# Altium project hw_design.PrjPcb (part 4 of 5)

## Sheet power_regulation.SchDoc
size A3; SheetNumber: 4; SheetTotal: 5
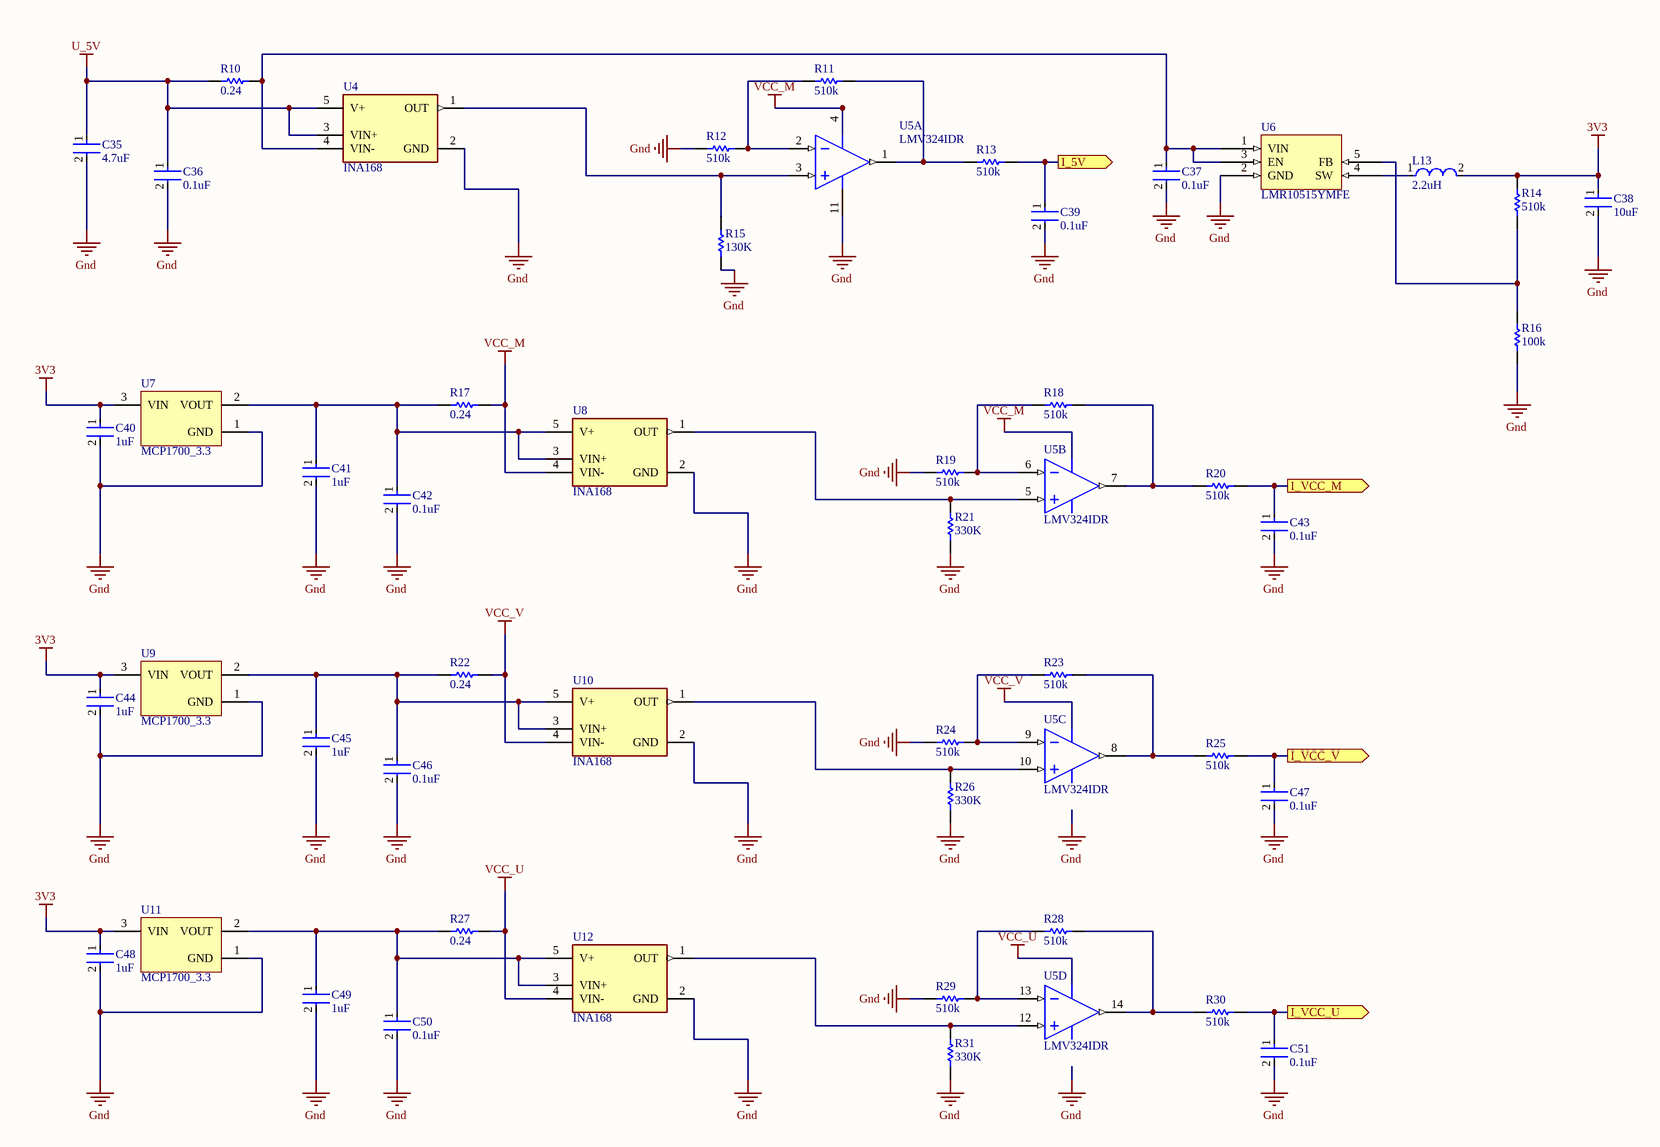
[diagram p3: power_regulation.SchDoc]

### Parts
C35  4.7uF  [FP-C0805C-DN-IPC_A]
C36  0.1uF  [FP-C0805C-DN-IPC_A]
C37  0.1uF  [FP-C0805C-DN-IPC_A]
C38  10uF  [FP-C0805C-DN-IPC_A]
C39  0.1uF  [FP-C0805C-DN-IPC_A]
C40  1uF  [FP-C0805C-DN-IPC_A]
C41  1uF  [FP-C0805C-DN-IPC_A]
C42  0.1uF  [FP-C0805C-DN-IPC_A]
C43  0.1uF  [FP-C0805C-DN-IPC_A]
C44  1uF  [FP-C0805C-DN-IPC_A]
C45  1uF  [FP-C0805C-DN-IPC_A]
C46  0.1uF  [FP-C0805C-DN-IPC_A]
C47  0.1uF  [FP-C0805C-DN-IPC_A]
C48  1uF  [FP-C0805C-DN-IPC_A]
C49  1uF  [FP-C0805C-DN-IPC_A]
C50  0.1uF  [FP-C0805C-DN-IPC_A]
C51  0.1uF  [FP-C0805C-DN-IPC_A]
L13  2.2uH  [FP-C0805C-DN-IPC_A]
R10  0.24  [FP-C0805C-DN-IPC_A]
R11  510k  [FP-C0805C-DN-IPC_A]
R12  510k  [FP-C0805C-DN-IPC_A]
R13  510k  [FP-C0805C-DN-IPC_A]
R14  510k  [FP-C0805C-DN-IPC_A]
R15  130K  [FP-C0805C-DN-IPC_A]
R16  100k  [FP-C0805C-DN-IPC_A]
R17  0.24  [FP-C0805C-DN-IPC_A]
R18  510k  [FP-C0805C-DN-IPC_A]
R19  510k  [FP-C0805C-DN-IPC_A]
R20  510k  [FP-C0805C-DN-IPC_A]
R21  330K  [FP-C0805C-DN-IPC_A]
R22  0.24  [FP-C0805C-DN-IPC_A]
R23  510k  [FP-C0805C-DN-IPC_A]
R24  510k  [FP-C0805C-DN-IPC_A]
R25  510k  [FP-C0805C-DN-IPC_A]
R26  330K  [FP-C0805C-DN-IPC_A]
R27  0.24  [FP-C0805C-DN-IPC_A]
R28  510k  [FP-C0805C-DN-IPC_A]
R29  510k  [FP-C0805C-DN-IPC_A]
R30  510k  [FP-C0805C-DN-IPC_A]
R31  330K  [FP-C0805C-DN-IPC_A]
U4  INA168  [FP-DBV0005A-IPC_A]
U5  LMV324IDR  [D0014A_V]  (parts A,B,C,D of 4)
U6  LMR10515YMFE  [SOT95P245X145-5N]
U7  MCP1700_3.3  [SOT-23-TT3_L]
U8  INA168  [FP-DBV0005A-IPC_A]
U9  MCP1700_3.3  [SOT-23-TT3_L]
U10  INA168  [FP-DBV0005A-IPC_A]
U11  MCP1700_3.3  [SOT-23-TT3_L]
U12  INA168  [FP-DBV0005A-IPC_A]

### Ports
I_5V (out), I_VCC_M (out), I_VCC_U (out), I_VCC_V (out)

### Nets
3V3: C38.1 C40.1 C44.1 C48.1 L13.2 R14.2 U7.3(VIN) U9.3(VIN) U11.3(VIN)
GND: C35.2 C36.2 C37.2 C38.2 C39.2 C40.2 C41.2 C42.2 C43.2 C44.2 C45.2 C46.2 C47.2 C48.2 C49.2 C50.2 C51.2 R12.2 R15.1 R16.1 R19.2 R21.1 R24.2 R26.1 R29.2 R31.1 U4.2(GND) U5.11(GND) U6.2(GND) U7.1(GND) U8.2(GND) U9.1(GND) U10.2(GND) U11.1(GND) U12.2(GND)
U_5V: C35.1 C36.1 R10.1 U4.3(VIN+) U4.5(V+)
VCC_M: R17.2 U5.4(VCC+) U8.4(VIN-)
VCC_U: R27.2 U12.4(VIN-)
VCC_V: R22.2 U10.4(VIN-)
I_5V: C39.1 R13.1 ; port I_5V
I_VCC_M: C43.1 R20.1 ; port I_VCC_M
I_VCC_U: C51.1 R30.1 ; port I_VCC_U
I_VCC_V: C47.1 R25.1 ; port I_VCC_V
NetC37_1: C37.1 R10.2 U4.4(VIN-) U6.1(VIN) U6.3(EN)
NetC41_1: C41.1 C42.1 R17.1 U7.2(VOUT) U8.3(VIN+) U8.5(V+)
NetC45_1: C45.1 C46.1 R22.1 U9.2(VOUT) U10.3(VIN+) U10.5(V+)
NetC49_1: C49.1 C50.1 R27.1 U11.2(VOUT) U12.3(VIN+) U12.5(V+)
NetL13_1: L13.1 U6.4(SW)
NetR11_1: R11.1 R13.2 U5.1(1OUT)
NetR11_2: R11.2 R12.1 U5.2(1IN-)
NetR14_1: R14.1 R16.2 U6.5(FB)
NetR15_2: R15.2 U4.1(OUT) U5.3(1IN+)
NetR18_1: R18.1 R20.2 U5.7(1OUT)
NetR18_2: R18.2 R19.1 U5.6(1IN-)
NetR21_2: R21.2 U5.5(1IN+) U8.1(OUT)
NetR23_1: R23.1 R25.2 U5.8(1OUT)
NetR23_2: R23.2 R24.1 U5.9(1IN-)
NetR26_2: R26.2 U5.10(1IN+) U10.1(OUT)
NetR28_1: R28.1 R30.2 U5.14(1OUT)
NetR28_2: R28.2 R29.1 U5.13(1IN-)
NetR31_2: R31.2 U5.12(1IN+) U12.1(OUT)

### Library data of the parts
C35 = C0805C475K3PACTU: Cap Ceramic 4.7uF 25V X5R 10% SMD 0805 85°C Plastic T/R; Manufacturer: KEMET; Dissipation Factor: 5%; Supplier 1: Digi-Key; Manufacturer Part Number: C0805C475K3PACTU; RoHS: Yes; Category: Ceramic Capacitors; Pricing 1: 1=0.36000, 10=0.24800, 50=0.16500, 100=0.14020, 500=0.09900, 1000=0.08662 (USD); Mount: PCB,Surface Mount; Case/Package: 0805; Number of Pins: 2; Case Code (Imperial): 0805; Case Code (Metric): 2012; Dielectric Material: Ceramic; Contact Plating: Tin,Matte; Min Operating Temperature: -55°C; Max Operating Temperature: 85°C; Capacitance: 4.7uF; Tolerance: 10%; Packaging: Tape and Reel; Dielectric: X5R; Package Quantity: 2500; Series: C0805C; Termination: SMD/SMT; Voltage Rating (DC): 25V; Construction: Flat; Voltage: 25V; Length: 2mm; Width: 1.2mm; Height: 1.25mm; Depth: 1.25mm; Radiation Hardening: No; RoHS Compliant: Yes; Lead Free: Lead Free; REACH SVHC: No SVHC; ComponentLink1URL: https://datasheet.ciiva.com/3776/c0603c102k5racturegion-naregion-na-3776917.pdf?src-supplier=Arrow+Electronics; ComponentLink1Description: https://datasheet.ciiva.com/3776/c0603c102k5racturegion-naregion-na-3776917.pdf?src-supplier=Arrow+Electronics; ComponentLink2URL: https://datasheet.ciiva.com/18193/getdatasheetpartid-385757-18193895.pdf?src-supplier=Verical; ComponentLink2Description: https://datasheet.ciiva.com/18193/getdatasheetpartid-385757-18193895.pdf?src-supplier=Verical; ComponentLink3URL: https://datasheet.ciiva.com/18193/getdatasheetpartid-195812-18193898.pdf?src-supplier=Verical; ComponentLink3Description: https://datasheet.ciiva.com/18193/getdatasheetpartid-195812-18193898.pdf?src-supplier=Verical; ComponentLink4URL: https://datasheet.ciiva.com/7842/40889-7842614.pdf?src-supplier=Element14; ComponentLink4Description: https://datasheet.ciiva.com/7842/40889-7842614.pdf?src-supplier=Element14; ComponentLink5URL: https://datasheet.ciiva.com/22748/1918694-22748309.pdf?src-supplier=Element14; ComponentLink5Description: https://datasheet.ciiva.com/22748/1918694-22748309.pdf?src-supplier=Element14; Supplier Part Number 1: 399-C0805C475K3PAC7800CT-ND; Stock 1: 10860
C36 C37 C39 C42 C43 C46 C47 C50 C51 = C0805C104K5RACTU: Cap Ceramic 0.1uF 50V X7R 10% SMD 2.0 x 1.2 mm 125 C Paper T/R; Manufacturer: KEMET; Capacitance: 100nF; Voltage: 500V; Supplier 1: Digi-Key; Manufacturer Part Number: C0805C104K5RACTU; RoHS: Yes; Category: Ceramic Capacitors; Pricing 1: 1=0.15000, 10=0.10500, 50=0.05960, 100=0.04940, 500=0.03466, 1000=0.02869 (USD); Mount: Surface Mount,PCB; Case/Package: 0805; Number of Pins: 2; Case Code (Imperial): 0805; Case Code (Metric): 2012; Dielectric Material: Ceramic; Contact Plating: Tin,Matte; Min Operating Temperature: -55°C; Max Operating Temperature: 125°C; Package Quantity: 4000; Voltage Rating: 50V; Tolerance: 10%; Packaging: Tape and Reel; Dielectric: X7R; Termination: SMD/SMT; Voltage Rating (DC): 50V; Series: C0805C; Construction: Flat; Length: 2mm; Width: 1.2mm; Height: 0.9mm; Thickness: 0.035inch; Depth: 1.25mm; Lead Pitch: 0.75mm; Radiation Hardening: No; REACH SVHC: No SVHC; RoHS Compliant: Yes; ComponentLink1URL: https://www.distrelec.biz/Web/Downloads/_t/ds/KEM_C1002_X7R_SMD_eng_tds.pdf?mime=application%2Fpdf&src-supplier=Distrelec; ComponentLink1Description: https://www.distrelec.biz/Web/Downloads/_t/ds/KEM_C1002_X7R_SMD_eng_tds.pdf?mime=application%2Fpdf&src-supplier=Distrelec; ComponentLink2URL: http://www.farnell.com/datasheets/2740684.pdf?src-supplier=Farnell; ComponentLink2Description: http://www.farnell.com/datasheets/2740684.pdf?src-supplier=Farnell; ComponentLink3URL: http://www.farnell.com/datasheets/2740684.pdf?src-supplier=Element14; ComponentLink3Description: http://www.farnell.com/datasheets/2740684.pdf?src-supplier=Element14; Supplier Part Number 1: 399-C0805C104K5RAC7800CT-ND; Stock 1: 2034176
C38 = GRM21BR61C106KE15L: 贴片电容（MLCC） 10μF ±10% 16V X5R 0805; Manufacturer: Murata; Material: Ceramic; Supplier 1: Digi-Key; Manufacturer Part Number: GRM21BR61C106KE15L; RoHS: Yes; Category: Ceramic Capacitors; Pricing 1: 1=0.18000, 10=0.12400, 50=0.07420, 100=0.06270, 500=0.04292, 1000=0.03798 (USD); Mount: Surface Mount; Case/Package: 0805; Case Code (Imperial): 0805; Case Code (Metric): 2012; Min Operating Temperature: -55°C; Max Operating Temperature: 85°C; Packaging: Tape and Reel; Capacitance: 10uF; Tolerance: 10%; Voltage Rating: 16V; Voltage Rating (DC): 16V; Package Quantity: 1; Dielectric: X5R; Termination: SMD/SMT; Voltage: 16V; Series: GRM; Construction: Flat; Length: 2mm; Width: 1.25mm; Height: 1.25mm; Thickness: 0.053inch; Depth: 1.25mm; Radiation Hardening: No; REACH SVHC: No SVHC; RoHS Compliant: Yes; Lead Free: Lead Free; ComponentLink1URL: https://datasheet.ciiva.com/7719/1747468-7719090.pdf?src-supplier=Element14; ComponentLink1Description: https://datasheet.ciiva.com/7719/1747468-7719090.pdf?src-supplier=Element14; ComponentLink2URL: https://datasheet.ciiva.com/23628/460993-23628598.pdf?src-supplier=Newark; ComponentLink2Description: https://datasheet.ciiva.com/23628/460993-23628598.pdf?src-supplier=Newark; ComponentLink3URL: https://datasheet.ciiva.com/2989/product-2989696.pdf?src-supplier=Avnet; ComponentLink3Description: https://datasheet.ciiva.com/2989/product-2989696.pdf?src-supplier=Avnet; ComponentLink4URL: https://datasheet.ciiva.com/3777/1956grm21br61c106ke1523-3777137.pdf?src-supplier=Arrow+Electronics; ComponentLink4Description: https://datasheet.ciiva.com/3777/1956grm21br61c106ke1523-3777137.pdf?src-supplier=Arrow+Electronics; ComponentLink5URL: https://datasheet.ciiva.com/29202/450891-da-01-de-vs-chip-kond-0805-10-0-uf-10pr-16-0v-x5r-29202696.pdf?src-supplier=Conrad; ComponentLink5Description: https://datasheet.ciiva.com/29202/450891-da-01-de-vs-chip-kond-0805-10-0-uf-10pr-16-0v-x5r-29202696.pdf?src-supplier=Conrad; ComponentLink6URL: https://datasheet.ciiva.com/29199/454607-da-01-en-vs-kondensator-0805-29199611.pdf?src-supplier=Conrad; ComponentLink6Description: https://datasheet.ciiva.com/29199/454607-da-01-en-vs-kondensator-0805-29199611.pdf?src-supplier=Conrad; ComponentLink7URL: https://datasheet.ciiva.com/137/partnumbering-e-01-137918.pdf?src-supplier=Digi-Key; ComponentLink7Description: https://datasheet.ciiva.com/137/partnumbering-e-01-137918.pdf?src-supplier=Digi-Key; ComponentLink8URL: https://datasheet.ciiva.com/137/partnumbering-e-01-137917.pdf?src-supplier=Digi-Key; ComponentLink8Description: https://datasheet.ciiva.com/137/partnumbering-e-01-137917.pdf?src-supplier=Digi-Key; ComponentLink9URL: https://datasheet.ciiva.com/137/partnumbering-e-01-137919.pdf?src-supplier=Digi-Key; ComponentLink9Description: https://datasheet.ciiva.com/137/partnumbering-e-01-137919.pdf?src-supplier=Digi-Key; ComponentLink10URL: https://datasheet.ciiva.com/2989/product-2989697.pdf?src-supplier=Avnet; ComponentLink10Description: https://datasheet.ciiva.com/2989/product-2989697.pdf?src-supplier=Avnet; Supplier Part Number 1: 490-3886-1-ND; Stock 1: 9508002
C40 C41 C44 C45 C48 C49 = C0805C105K4PACTU: Cap Ceramic 1uF 16V X5R 10% SMD 0805 85C Plastic T/R; Manufacturer: KEMET; Dissipation Factor: 5%; Supplier 1: Digi-Key; Manufacturer Part Number: C0805C105K4PACTU; RoHS: Yes; Category: Ceramic Capacitors; Pricing 1: 1=0.20000, 10=0.13400, 50=0.08060, 100=0.06810, 500=0.04662, 1000=0.04124 (USD); Mount: Surface Mount,PCB; Case/Package: 0805; Case Code (Metric): 2012; Case Code (Imperial): 0805; Dielectric Material: Ceramic; Min Operating Temperature: -55°C; Max Operating Temperature: 85°C; Capacitance: 1uF; Tolerance: 10%; Packaging: Tape and Reel; Voltage Rating: 16V; Package Quantity: 1; Voltage Rating (DC): 16V; Dielectric: X5R; Termination: SMD/SMT; Voltage: 16V; Series: C0805C; Construction: Flat; Length: 2mm; Width: 0.049inch; Height: 1.25mm; Thickness: 0.055inch; Depth: 1.25mm; Radiation Hardening: No; REACH SVHC: No SVHC; RoHS Compliant: Yes; Lead Free: Lead Free; ComponentLink1URL: http://www.farnell.com/datasheets/2745930.pdf?src-supplier=Farnell; ComponentLink1Description: http://www.farnell.com/datasheets/2745930.pdf?src-supplier=Farnell; ComponentLink2URL: http://uk.rs-online.com/webdocs/13da/0900766b813daa10.pdf?src-supplier=RSComponents; ComponentLink2Description: http://uk.rs-online.com/webdocs/13da/0900766b813daa10.pdf?src-supplier=RSComponents; ComponentLink3URL: http://components.arrow.com/part/dataview/43037300S8313636N7429?src-supplier=Arrow+Electronics; ComponentLink3Description: http://components.arrow.com/part/dataview/43037300S8313636N7429?src-supplier=Arrow+Electronics; ComponentLink4URL: http://uk.rs-online.com/webdocs/13da/0900766b813daa0f.pdf?src-supplier=RSComponents; ComponentLink4Description: http://uk.rs-online.com/webdocs/13da/0900766b813daa0f.pdf?src-supplier=RSComponents; ComponentLink5URL: https://search.kemet.com/component-edge/download/datasheet/C0805C105K4PAC.pdf?src-supplier=Avnet; ComponentLink5Description: https://search.kemet.com/component-edge/download/datasheet/C0805C105K4PAC.pdf?src-supplier=Avnet; ComponentLink6URL: http://www.farnell.com/datasheets/2745930.pdf?src-supplier=Newark; ComponentLink6Description: http://www.farnell.com/datasheets/2745930.pdf?src-supplier=Newark; ComponentLink7URL: https://search.kemet.com/component-edge/download/datasheet/C0805C105K4PAC.pdf?src-supplier=Allied+Electronics; ComponentLink7Description: https://search.kemet.com/component-edge/download/datasheet/C0805C105K4PAC.pdf?src-supplier=Allied+Electronics; ComponentLink8URL: http://www.farnell.com/datasheets/2745930.pdf?src-supplier=Element14; ComponentLink8Description: http://www.farnell.com/datasheets/2745930.pdf?src-supplier=Element14; ComponentLink9URL: https://www.verical.com/server-webapp/html/getDatasheet?partID=127986&src-supplier=Verical; ComponentLink9Description: https://www.verical.com/server-webapp/html/getDatasheet?partID=127986&src-supplier=Verical; ComponentLink10URL: http://www.farnell.com/datasheets/1824493.pdf?src-supplier=Newark; ComponentLink10Description: http://www.farnell.com/datasheets/1824493.pdf?src-supplier=Newark; ComponentLink11URL: http://www.kemet.com/Lists/ProductCatalog/Attachments/19/KEM_C1006_X5R_SMD.pdf?src-supplier=Avnet; ComponentLink11Description: http://www.kemet.com/Lists/ProductCatalog/Attachments/19/KEM_C1006_X5R_SMD.pdf?src-supplier=Avnet; ComponentLink12URL: https://search.kemet.com/component-edge/download/datasheet/C0805C105K4PAC.pdf?src-supplier=Mouser; ComponentLink12Description: https://search.kemet.com/component-edge/download/datasheet/C0805C105K4PAC.pdf?src-supplier=Mouser; ComponentLink13URL: https://api.kemet.com/component-edge/download/datasheet/C0805C105K4PAC.pdf?src-supplier=Digi-Key; ComponentLink13Description: https://api.kemet.com/component-edge/download/datasheet/C0805C105K4PAC.pdf?src-supplier=Digi-Key; ComponentLink14URL: https://search.kemet.com/component-edge/download/datasheet/C0805C105K4PAC.pdf?src-supplier=TTI; ComponentLink14Description: https://search.kemet.com/component-edge/download/datasheet/C0805C105K4PAC.pdf?src-supplier=TTI; Supplier Part Number 1: 399-C0805C105K4PAC7800CT-ND; Stock 1: 112717
L13 = LQM21PN2R2MC0D: 0805 2.2uH ±20% DCR=340mΩ 600mA SRF=50MHz; Manufacturer: Murata; Core Material: Ferrite; Shielding: Shielded; DC Resistance (DCR): 340mR; Test Frequency: 1MHz; Self Resonant Frequency: 50MHz; Manufacturer Part Number: LQM21PN2R2MC0D; RoHS: Yes; Category: Fixed Inductors; Pricing 1: 1=0.24000, 10=0.21400, 25=0.18760, 50=0.16060, 100=0.14730, 250=0.13388, 500=0.12584, 1000=0.09639 (USD); Mount: Surface Mount; Case/Package: 0805; Case Code (Metric): 2012; Case Code (Imperial): 0805; Min Operating Temperature: -55°C; Max Operating Temperature: 125°C; Package Quantity: 4000; Current Rating: 600mA; Tolerance: 20%; Packaging: Tape and Reel; Max DC Current: 600mA; Termination: SMD/SMT; DC Current: 600mA; Series: LQM21PN_CO; Inductance Tolerance: 20%; Rated Current-Max: 600mA; Length: 2mm; Width: 0.049inch; Height: 0.5mm; Height - Seated (Max): 0.022inch; Depth: 1.45mm; Radiation Hardening: No; RoHS Compliant: Yes; Lead Free: Lead Free; Military Standard: Not; REACH SVHC: No SVHC; ComponentLink1URL: https://datasheet.ciiva.com/30490/0900766b81256150-30490215.pdf?src-supplier=RSComponents; ComponentLink1Description: https://datasheet.ciiva.com/30490/0900766b81256150-30490215.pdf?src-supplier=RSComponents; ComponentLink2URL: https://datasheet.ciiva.com/16456/l0075s0104lqm21p-c0-16456044.pdf?src-supplier=Future+Electronics; ComponentLink2Description: https://datasheet.ciiva.com/16456/l0075s0104lqm21p-c0-16456044.pdf?src-supplier=Future+Electronics; Supplier Part Number 1: 490-4994-1-ND; Stock 1: 52990; Supplier 1: Digi-Key; Inductance: 2.2uH
R10 R17 R22 R27 = RL1220S-R24-F: Res Thin Film 0805 0.24 Ohm 1% 0.33W(1/3W) 0ppm/C to 200ppm/C Pad SMD Automotive T/R; Manufacturer: Susumu; Resistance: 240mR; Temperature Coefficient: 200ppm/°C; Max Power Dissipation: 333mW; Power Rating: 250mW; Voltage Rating (DC): 100V; Supplier 1: Digi-Key; Manufacturer Part Number: RL1220S-R24-F; RoHS: Yes; Category: Chip SMD Resistors; Pricing 1: 1=0.29000, 10=0.24300, 25=0.17640, 50=0.12780, 100=0.09480, 250=0.07276, 500=0.05732, 1000=0.03969 (USD); Case/Package: 0805; Number of Pins: 2; Case Code (Metric): 2012; Case Code (Imperial): 0805; Weight: 0.000194oz; Size Code: 0805; Min Operating Temperature: -55°C; Max Operating Temperature: 125°C; Tolerance: 1%; Package Quantity: 1; Packaging: Cut Tape; Series: RL; Resistor Type: Thin Film; Number of Terminations: 2; Termination: SMD/SMT; Technology: THIN FILM; Resistance Tolerance: 1%; Length: 0.079inch; Width: 0.049inch; Height: 0.02inch; RoHS Compliant: Yes; Lead Free: Lead Free; REACH SVHC: Unknown; ComponentLink1URL: https://datasheet.ciiva.com/2499/rl-data-sheet-2499763.pdf?src-supplier=Digi-Key; ComponentLink1Description: https://datasheet.ciiva.com/2499/rl-data-sheet-2499763.pdf?src-supplier=Digi-Key; ComponentLink2URL: https://datasheet.ciiva.com/2499/rl-data-sheet-2499764.pdf?src-supplier=Digi-Key; ComponentLink2Description: https://datasheet.ciiva.com/2499/rl-data-sheet-2499764.pdf?src-supplier=Digi-Key; ComponentLink3URL: https://datasheet.ciiva.com/2499/rl-data-sheet-2499765.pdf?src-supplier=Digi-Key; ComponentLink3Description: https://datasheet.ciiva.com/2499/rl-data-sheet-2499765.pdf?src-supplier=Digi-Key; ComponentLink4URL: https://datasheet.ciiva.com/12915/e-15-16-12915592.pdf?src-supplier=Mouser; ComponentLink4Description: https://datasheet.ciiva.com/12915/e-15-16-12915592.pdf?src-supplier=Mouser; ComponentLink5URL: https://datasheet.ciiva.com/22657/87305-22657723.pdf?src-supplier=Element14; ComponentLink5Description: https://datasheet.ciiva.com/22657/87305-22657723.pdf?src-supplier=Element14; Supplier Part Number 1: RL12S.24FCT-ND; Stock 1: 290743
R11-R14 R18-R20 R23-R25 R28-R30 = ERJ6ENF5103V: 贴片电阻 510KΩ ±1% 1/8W ±100ppm/℃ 0805; Manufacturer: Panasonic; Resistance: 510kR; Power Rating: 125mW; Voltage Rating: 150V; Temperature Coefficient: 100ppm/°C; Supplier 1: Digi-Key; Manufacturer Part Number: ERJ6ENF5103V; RoHS: Yes; Category: Chip SMD Resistors; Pricing 1: 1=0.10000, 10=0.08900, 100=0.03440, 1000=0.01512, 2500=0.01306 (USD); Mount: Surface Mount; Case/Package: 0805; Case Code (Metric): 2012; Case Code (Imperial): 0805; Contact Plating: Tin; Size Code: 0805; Min Operating Temperature: -55°C; Max Operating Temperature: 155°C; Tolerance: 1%; Packaging: Tape and Reel; Package Quantity: 1; Resistor Type: Thick Film; Number of Terminations: 2; Max Power Dissipation: 125mW; Series: ERJ; Construction: Rectangular; Termination: SMD/SMT; Features: Automotive AEC-Q200; Voltage Rating (DC): 150V; Resistance Tolerance: 1%; Technology: THICK FILM; Length: 2mm; Width: 0.049inch; Height: 0.6mm; Depth: 1.25mm; Radiation Hardening: No; Military Standard: Not; RoHS Compliant: Yes; REACH SVHC: No SVHC; Lead Free: Lead Free; ComponentLink1URL: https://datasheet.ciiva.com/11821/0900766b80f80784-11821669.pdf?src-supplier=RSComponents; ComponentLink1Description: https://datasheet.ciiva.com/11821/0900766b80f80784-11821669.pdf?src-supplier=RSComponents; ComponentLink2URL: https://datasheet.ciiva.com/46375/1678782-46375866.pdf?src-supplier=Element14; ComponentLink2Description: https://datasheet.ciiva.com/46375/1678782-46375866.pdf?src-supplier=Element14; ComponentLink3URL: https://datasheet.ciiva.com/22762/1678782-22762871.pdf?src-supplier=Farnell; ComponentLink3Description: https://datasheet.ciiva.com/22762/1678782-22762871.pdf?src-supplier=Farnell; ComponentLink4URL: https://datasheet.ciiva.com/46375/1678782-46375865.pdf?src-supplier=Element14; ComponentLink4Description: https://datasheet.ciiva.com/46375/1678782-46375865.pdf?src-supplier=Element14; ComponentLink5URL: https://datasheet.ciiva.com/24027/aoa0000ce2-24027049.pdf?src-supplier=Mouser; ComponentLink5Description: https://datasheet.ciiva.com/24027/aoa0000ce2-24027049.pdf?src-supplier=Mouser; ComponentLink6URL: https://datasheet.ciiva.com/9181/aoa0000ce2-9181533.pdf?src-supplier=Avnet; ComponentLink6Description: https://datasheet.ciiva.com/9181/aoa0000ce2-9181533.pdf?src-supplier=Avnet; ComponentLink7URL: https://datasheet.ciiva.com/30195/aoa0000ce2-30195599.pdf?src-supplier=Onlinecomponents.com; ComponentLink7Description: https://datasheet.ciiva.com/30195/aoa0000ce2-30195599.pdf?src-supplier=Onlinecomponents.com; Supplier Part Number 1: P510KCCT-ND; Stock 1: 22956
R15 = ERA-6AEB134V: Res Thin Film 0805 130K Ohm 0.1% 1/8W ±25ppm/°C Molded SMD SMD Punched Carrier T/R; Manufacturer: Panasonic; Resistance: 130kR; Power Rating: 125mW; Voltage Rating: 100V; Supplier 1: Digi-Key; Manufacturer Part Number: ERA-6AEB134V; RoHS: Yes; Category: Chip SMD Resistors; Pricing 1: 1=0.36000, 10=0.30100, 100=0.11770, 1000=0.04927, 2500=0.04516 (USD); Mount: Surface Mount; Case/Package: 0805; Number of Pins: 2; Case Code (Metric): 2012; Case Code (Imperial): 0805; Contact Plating: Tin; Min Operating Temperature: -55°C; Max Operating Temperature: 155°C; Tolerance: 0.1%; Packaging: Tape and Reel; Package Quantity: 1; Resistor Type: Thin Film; Number of Terminations: 2; Temperature Coefficient: 25ppm/°C; Termination: Solder; Max Power Dissipation: 125mW; Series: ERA-6A; Resistance Tolerance: 0.1%; Construction: Rectangular; Voltage Rating (DC): 100V; Features: Automotive AEC-Q200; Technology: THIN FILM; Length: 2mm; Width: 1.25mm; Height: 0.5mm; Depth: 1.25mm; Radiation Hardening: No; REACH SVHC: No SVHC; Military Standard: Not; RoHS Compliant: Yes; Lead Free: Lead Free; ComponentLink1URL: https://datasheet.ciiva.com/26335/453691-da-01-en-widerstand-0805-era-26335728.pdf?src-supplier=Conrad; ComponentLink1Description: https://datasheet.ciiva.com/26335/453691-da-01-en-widerstand-0805-era-26335728.pdf?src-supplier=Conrad; ComponentLink2URL: https://datasheet.ciiva.com/5915/485442-5915198.pdf?src-supplier=Farnell; ComponentLink2Description: https://datasheet.ciiva.com/5915/485442-5915198.pdf?src-supplier=Farnell; ComponentLink3URL: https://datasheet.ciiva.com/46376/485442-46376974.pdf?src-supplier=Element14; ComponentLink3Description: https://datasheet.ciiva.com/46376/485442-46376974.pdf?src-supplier=Element14; ComponentLink4URL: https://datasheet.ciiva.com/7795/485442-7795115.pdf?src-supplier=Element14; ComponentLink4Description: https://datasheet.ciiva.com/7795/485442-7795115.pdf?src-supplier=Element14; ComponentLink5URL: https://datasheet.ciiva.com/22739/485442-22739481.pdf?src-supplier=Element14; ComponentLink5Description: https://datasheet.ciiva.com/22739/485442-22739481.pdf?src-supplier=Element14; ComponentLink6URL: https://datasheet.ciiva.com/24023/aoa0000ce26-197354-24023974.pdf?src-supplier=Mouser; ComponentLink6Description: https://datasheet.ciiva.com/24023/aoa0000ce26-197354-24023974.pdf?src-supplier=Mouser; ComponentLink7URL: https://datasheet.ciiva.com/9185/aoa0000ce26-9185919.pdf?src-supplier=Avnet; ComponentLink7Description: https://datasheet.ciiva.com/9185/aoa0000ce26-9185919.pdf?src-supplier=Avnet; ComponentLink8URL: https://datasheet.ciiva.com/30125/54aoa0000ce26-30125359.pdf?src-supplier=Onlinecomponents.com; ComponentLink8Description: https://datasheet.ciiva.com/30125/54aoa0000ce26-30125359.pdf?src-supplier=Onlinecomponents.com; Supplier Part Number 1: P130KDACT-ND; Stock 1: 57925
R16 = RC0805FR-07100KL: 贴片电阻 100000Ω ± 1.00% 0.125W ± 100ppm/℃ 0805; Manufacturer: Yageo; Tolerance: 1%; Voltage Rating: 150V; Temperature Coefficient: 100ppm/°C; Resistance: 100kR; Power Rating: 125mW; Supplier 1: Digi-Key; Manufacturer Part Number: RC0805FR-07100KL; RoHS: Yes; Category: Chip SMD Resistors; Pricing 1: 1=0.10000, 10=0.04200, 100=0.01690, 1000=0.00759, 2500=0.00659 (USD); Case/Package: 0805; Number of Pins: 2; Case Code (Metric): 2012; Case Code (Imperial): 0805; Size Code: 0805; Min Operating Temperature: -55°C; Max Operating Temperature: 155°C; Voltage Rating (DC): 150V; Packaging: Tape and Reel; Termination: SMD/SMT; Series: RC; Package Quantity: 1; Resistor Type: Thick Film; Number of Terminations: 2; Max Power Dissipation: 125mW; Resistance Tolerance: 1%; Features: Moisture Resistant; Construction: Rectangular; Technology: THICK FILM; Length: 2mm; Width: 0.049inch; Height: 0.024inch; Depth: 1.25mm; Lead Pitch: 0.4mm; REACH SVHC: Unknown; RoHS Compliant: Yes; Lead Free: Lead Free; Military Standard: Not; ComponentLink1URL: https://datasheet.ciiva.com/7941/1686128-7941677.pdf?src-supplier=Element14; ComponentLink1Description: https://datasheet.ciiva.com/7941/1686128-7941677.pdf?src-supplier=Element14; ComponentLink2URL: https://datasheet.ciiva.com/7660/38627-7660796.pdf?src-supplier=Element14; ComponentLink2Description: https://datasheet.ciiva.com/7660/38627-7660796.pdf?src-supplier=Element14; Supplier Part Number 1: 311-100KCRCT-ND; Stock 1: 2547195
R21 R26 R31 = CRCW0805330KJNEA: Res Thick Film 0805 330K Ohm 5% 1/8W ±200ppm/°C Molded SMD SMD Paper T/R; Manufacturer: Vishay Dale; Voltage Rating: 150V; Resistance: 330kR; Power Rating: 125mW; Supplier 1: Digi-Key; Manufacturer Part Number: CRCW0805330KJNEA; RoHS: Yes; Category: Chip SMD Resistors; Pricing 1: 1=0.10000, 10=0.05000, 100=0.02040, 1000=0.00914, 2500=0.00794 (USD); Case/Package: 0805; Case Code (Imperial): 0805; Case Code (Metric): 2012; Contact Plating: Tin; Weight: 0.000194oz; Size Code: 0805; Min Operating Temperature: -55°C; Max Operating Temperature: 155°C; Packaging: Tape and Reel; Tolerance: 5%; Package Quantity: 1; Termination: SMD/SMT; Series: CRCW; Construction: Rectangular; Resistor Type: Thick Film; Number of Terminations: 2; Max Power Dissipation: 125mW; Temperature Coefficient: 200ppm/°C; Voltage Rating (DC): 150V; Resistance Tolerance: 5%; Features: Automotive AEC-Q200; Technology: THICK FILM; Length: 2mm; Width: 1.25mm; Height: 0.02inch; Depth: 1.25mm; Radiation Hardening: No; REACH SVHC: Unknown; Military Standard: Not; RoHS Compliant: Yes; Lead Free: Lead Free; ComponentLink1URL: https://datasheet.ciiva.com/2493/dcrcwe3-2493836.pdf?src-supplier=Digi-Key; ComponentLink1Description: https://datasheet.ciiva.com/2493/dcrcwe3-2493836.pdf?src-supplier=Digi-Key; ComponentLink2URL: https://datasheet.ciiva.com/2493/dcrcwe3-2493837.pdf?src-supplier=Digi-Key; ComponentLink2Description: https://datasheet.ciiva.com/2493/dcrcwe3-2493837.pdf?src-supplier=Digi-Key; ComponentLink3URL: https://datasheet.ciiva.com/5561/dcrcwe3-109170-5561991.pdf?src-supplier=Mouser; ComponentLink3Description: https://datasheet.ciiva.com/5561/dcrcwe3-109170-5561991.pdf?src-supplier=Mouser; ComponentLink4URL: https://datasheet.ciiva.com/2493/dcrcwe3-2493835.pdf?src-supplier=Digi-Key; ComponentLink4Description: https://datasheet.ciiva.com/2493/dcrcwe3-2493835.pdf?src-supplier=Digi-Key; ComponentLink5URL: https://datasheet.ciiva.com/46391/1807946-46391932.pdf?src-supplier=Element14; ComponentLink5Description: https://datasheet.ciiva.com/46391/1807946-46391932.pdf?src-supplier=Element14; ComponentLink6URL: https://datasheet.ciiva.com/16213/dcrcwe3-16213979.pdf?src-supplier=Future+Electronics; ComponentLink6Description: https://datasheet.ciiva.com/16213/dcrcwe3-16213979.pdf?src-supplier=Future+Electronics; ComponentLink7URL: https://datasheet.ciiva.com/16778/70201119-16778586.pdf?src-supplier=Allied+Electronics; ComponentLink7Description: https://datasheet.ciiva.com/16778/70201119-16778586.pdf?src-supplier=Allied+Electronics; Supplier Part Number 1: 541-330KACT-ND; Stock 1: 1
U4 U8 U10 U12 = INA168QPWRQ1: AEC-Q100, 2.7 to 60V, 800kHz Variable gain current sense amplifier 8-TSSOP -40 to 125; Manufacturer: Texas Instruments; Min Supply Voltage: 2.7V; Nominal Supply Current: 45uA; Common Mode Rejection Ratio: 100dB; Number of Channels: 1; Input Offset Voltage (Vos): 2mV; Input Bias Current: 10nA; Accuracy: 0.5%; Supplier 1: Digi-Key; Manufacturer Part Number: INA168QPWRQ1; RoHS: Yes; Category: Amplifiers - Op Amps, Buffer, Instrumentation; Pricing 1: 1=3.24000, 10=2.91100, 25=2.75240, 100=2.38530, 250=2.26300, 500=2.03058, 1000=2.01950 (USD); Mount: Surface Mount; Case/Package: TSSOP; Number of Pins: 8; Weight: 0.001217oz; Min Operating Temperature: -40°C; Max Operating Temperature: 125°C; Max Supply Voltage: 60V; Packaging: Tape and Reel; Package Quantity: 1; Number of Elements: 1; Series: -; Supply Current: 45uA; Radiation Hardening: No; Lead Free: Lead Free; RoHS Compliant: Yes; ComponentLink1URL: https://datasheet.ciiva.com/15128/getdatasheetpartid-194017-15128474.pdf?src-supplier=Verical; ComponentLink1Description: https://datasheet.ciiva.com/15128/getdatasheetpartid-194017-15128474.pdf?src-supplier=Verical; ComponentLink2URL: https://datasheet.ciiva.com/2975/ina168-q1-2975797.pdf?src-supplier=Avnet; ComponentLink2Description: https://datasheet.ciiva.com/2975/ina168-q1-2975797.pdf?src-supplier=Avnet; ComponentLink3URL: https://datasheet.ciiva.com/1939/ina138-q1-1939748.pdf?src-supplier=Digi-Key; ComponentLink3Description: https://datasheet.ciiva.com/1939/ina138-q1-1939748.pdf?src-supplier=Digi-Key; ComponentLink4URL: https://datasheet.ciiva.com/1939/ina138-q1-1939747.pdf?src-supplier=Digi-Key; ComponentLink4Description: https://datasheet.ciiva.com/1939/ina138-q1-1939747.pdf?src-supplier=Digi-Key; ComponentLink5URL: https://datasheet.ciiva.com/1939/ina138-q1-1939749.pdf?src-supplier=Digi-Key; ComponentLink5Description: https://datasheet.ciiva.com/1939/ina138-q1-1939749.pdf?src-supplier=Digi-Key; ComponentLink6URL: https://datasheet.ciiva.com/2976/ina168-q1-2976124.pdf?src-supplier=Avnet; ComponentLink6Description: https://datasheet.ciiva.com/2976/ina168-q1-2976124.pdf?src-supplier=Avnet; Supplier Part Number 1: 296-17201-1-ND; Stock 1: 168
U5 = LMV324IDR: IC OPAMP GP 1MHZ RRO 14SOIC; Manufacturer: Texas Instruments; Number of Channels: 4; Output Current: 160mA; Slew Rate: 1V/µs; Nominal Supply Current: 170uA; Common Mode Rejection Ratio: 50dB; Voltage Gain: 100dB; Input Bias Current: 250nA; Input Offset Voltage (Vos): 7mV; Operating Supply Current: 410uA; Max Supply Voltage: 5.5V; Min Supply Voltage: 2.7V; Supplier 1: Digi-Key; Manufacturer Part Number: LMV324IDR; RoHS: Yes; Category: Amplifiers - Op Amps, Buffer, Instrumentation; Pricing 1: 1=0.62000, 10=0.53300, 25=0.49720, 100=0.39770, 250=0.36932, 500=0.31248, 1000=0.24147 (USD); Mount: Surface Mount; Case/Package: SOIC; Number of Pins: 14; Contact Plating: Gold; Min Operating Temperature: -40°C; Max Operating Temperature: 125°C; Packaging: Tape and Reel; Number of Circuits: 4; Gain Bandwidth Product: 1MHz; Package Quantity: 1; Output Current per Channel: 160mA; Unity Gain Bandwidth Product: 1MHz; Bandwidth: 1MHz; Number of Elements: 4; Number of Amplifiers: 4; Power Supply Rejection Ratio (PSRR): 50dB; Length: 8.65mm; Width: 3.91mm; Height: 1.58mm; Radiation Hardening: No; Lead Free: Lead Free; RoHS Compliant: Yes; REACH SVHC: No SVHC; ComponentLink1URL: https://datasheet.ciiva.com/27050/903031-27050788.pdf?src-supplier=Jameco; ComponentLink1Description: https://datasheet.ciiva.com/27050/903031-27050788.pdf?src-supplier=Jameco; ComponentLink2URL: https://datasheet.ciiva.com/1803/lmv324-1803154.pdf?src-supplier=Digi-Key; ComponentLink2Description: https://datasheet.ciiva.com/1803/lmv324-1803154.pdf?src-supplier=Digi-Key; ComponentLink3URL: https://datasheet.ciiva.com/1803/lmv324-1803153.pdf?src-supplier=Digi-Key; ComponentLink3Description: https://datasheet.ciiva.com/1803/lmv324-1803153.pdf?src-supplier=Digi-Key; ComponentLink4URL: https://datasheet.ciiva.com/1803/lmv324-1803155.pdf?src-supplier=Digi-Key; ComponentLink4Description: https://datasheet.ciiva.com/1803/lmv324-1803155.pdf?src-supplier=Digi-Key; ComponentLink5URL: https://datasheet.ciiva.com/2973/lmv358-2973572.pdf?src-supplier=Avnet; ComponentLink5Description: https://datasheet.ciiva.com/2973/lmv358-2973572.pdf?src-supplier=Avnet; ComponentLink6URL: https://datasheet.ciiva.com/2973/lmv358-2973571.pdf?src-supplier=Avnet; ComponentLink6Description: https://datasheet.ciiva.com/2973/lmv358-2973571.pdf?src-supplier=Avnet; Supplier Part Number 1: 296-9569-6-ND
U6 = LMR10515YMFE/NOPB: 5.5Vin, 1.5A Step-Down Voltage Regulator in SOT-23 and LLP 5-SOT-23 -40 to 125; Manufacturer: TI National Semiconductor; Number of Outputs: 1; Output Voltage: 4.5V; Min Input Voltage: 3V; Max Input Voltage: 5.5V; Switching Frequency: 3MHz; Min Output Voltage: 600mV; Quiescent Current: 3.3mA; Output Type: Adjustable; Output Configuration: Positive; Synchronous Rectifier: No; Efficiency: 93%; Supplier 1: Digi-Key; Manufacturer Part Number: LMR10515YMFE/NOPB; RoHS: Yes; Category: Voltage Regulators - Switching; Pricing 1: 1=1.57000, 10=1.40400, 25=1.33280, 100=1.09470 (USD); Mount: Surface Mount; Case/Package: SOT-23-5; Number of Pins: 5; Contact Plating: Tin,Matte; Min Operating Temperature: -40°C; Max Operating Temperature: 125°C; Max Output Current: 1.5A; Output Current: 1.5A; Packaging: Tape and Reel; Package Quantity: 250; Max Output Voltage: 4.5V; Series: SIMPLE SWITCHER®; Length: 3.05mm; Width: 1.75mm; Height: 1.3mm; Radiation Hardening: No; REACH SVHC: No SVHC; Lead Free: Lead Free; RoHS Compliant: Yes; ComponentLink1URL: https://datasheet.ciiva.com/41458/001014244-da-01-en-ic-reg-bu-lmr10515ymfe-nopb-sot-23-5-tid-41458601.pdf?src-supplier=Conrad; ComponentLink1Description: https://datasheet.ciiva.com/41458/001014244-da-01-en-ic-reg-bu-lmr10515ymfe-nopb-sot-23-5-tid-41458601.pdf?src-supplier=Conrad; ComponentLink2URL: https://datasheet.ciiva.com/22669/1882168-22669494.pdf?src-supplier=Element14; ComponentLink2Description: https://datasheet.ciiva.com/22669/1882168-22669494.pdf?src-supplier=Element14; ComponentLink3URL: https://datasheet.ciiva.com/3230/lmr10515-3230063.pdf?src-supplier=Avnet; ComponentLink3Description: https://datasheet.ciiva.com/3230/lmr10515-3230063.pdf?src-supplier=Avnet; ComponentLink4URL: https://datasheet.ciiva.com/2029/lmr10515-2029543.pdf?src-supplier=Digi-Key; ComponentLink4Description: https://datasheet.ciiva.com/2029/lmr10515-2029543.pdf?src-supplier=Digi-Key; ComponentLink5URL: https://datasheet.ciiva.com/2029/lmr10515-2029544.pdf?src-supplier=Digi-Key; ComponentLink5Description: https://datasheet.ciiva.com/2029/lmr10515-2029544.pdf?src-supplier=Digi-Key; ComponentLink6URL: https://datasheet.ciiva.com/2029/lmr10515-2029542.pdf?src-supplier=Digi-Key; ComponentLink6Description: https://datasheet.ciiva.com/2029/lmr10515-2029542.pdf?src-supplier=Digi-Key; Supplier Part Number 1: LMR10515YMFE/NOPBCT-ND; Stock 1: 3772
U7 U9 U11 = MCP1700T-3302E/TT: IC REG LDO 3.3V 0.25A SOT23-3; Manufacturer: Microchip; Number of Outputs: 1; Min Input Voltage: 2.3V; Max Input Voltage: 6V; Dropout Voltage: 178mV; Output Current: 250mA; Max Power Dissipation: 369.6mW; Input Bias Current: 1.6uA; Polarity: Positive; Quiescent Current: 4uA; Accuracy: 2%; Output Type: Fixed; Supplier 1: Digi-Key; Manufacturer Part Number: MCP1700T-3302E/TT; RoHS: Yes; Category: Voltage Regulators - Linear; Pricing 1: 1=0.46000, 25=0.38160, 100=0.37500 (USD); Mount: Surface Mount; Case/Package: SOT-23; Number of Pins: 3; Contact Plating: Tin,Matte; Min Operating Temperature: -40°C; Max Operating Temperature: 125°C; Packaging: Tape and Reel; Output Voltage: 3.3V; Max Output Current: 250mA; Package Quantity: 3000; Min Output Voltage: 3.3V; Nominal Output Voltage: 3.3V; Output Voltage Accuracy: 2%; Nominal Supply Current: 4uA; Supply Current: 4uA; Max Supply Voltage: 6V; Min Supply Voltage: 2.3V; Max Output Voltage: 3.3V; Termination: SMD/SMT; Power Dissipation: 369.6mW; Length: 2.9mm; Width: 1.3mm; Height: 0.95mm; Radiation Hardening: No; Lead Free: Lead Free; RoHS Compliant: Yes; REACH SVHC: No SVHC; ComponentLink1URL: https://datasheet.ciiva.com/5801/1784514-5801824.pdf?src-supplier=Farnell; ComponentLink1Description: https://datasheet.ciiva.com/5801/1784514-5801824.pdf?src-supplier=Farnell; ComponentLink2URL: https://datasheet.ciiva.com/2040/21826b-2040112.pdf?src-supplier=Digi-Key; ComponentLink2Description: https://datasheet.ciiva.com/2040/21826b-2040112.pdf?src-supplier=Digi-Key; ComponentLink3URL: https://datasheet.ciiva.com/7649/1784514-7649813.pdf?src-supplier=Element14; ComponentLink3Description: https://datasheet.ciiva.com/7649/1784514-7649813.pdf?src-supplier=Element14; ComponentLink4URL: https://datasheet.ciiva.com/22710/1784514-22710988.pdf?src-supplier=Element14; ComponentLink4Description: https://datasheet.ciiva.com/22710/1784514-22710988.pdf?src-supplier=Element14; ComponentLink5URL: https://datasheet.ciiva.com/14150/mcp1700-eng-tds-14150122.pdf?src-supplier=Distrelec; ComponentLink5Description: https://datasheet.ciiva.com/14150/mcp1700-eng-tds-14150122.pdf?src-supplier=Distrelec; ComponentLink6URL: https://datasheet.ciiva.com/8041/1784514-8041598.pdf?src-supplier=Element14; ComponentLink6Description: https://datasheet.ciiva.com/8041/1784514-8041598.pdf?src-supplier=Element14; ComponentLink7URL: https://datasheet.ciiva.com/3224/jp011779-3224133.pdf?src-supplier=Avnet; ComponentLink7Description: https://datasheet.ciiva.com/3224/jp011779-3224133.pdf?src-supplier=Avnet; ComponentLink8URL: https://datasheet.ciiva.com/16208/filehandler-aspxddocname-en011779-16208911.pdf?src-supplier=Future+Electronics; ComponentLink8Description: https://datasheet.ciiva.com/16208/filehandler-aspxddocname-en011779-16208911.pdf?src-supplier=Future+Electronics; ComponentLink9URL: https://datasheet.ciiva.com/15200/getdatasheetpartid-453599-15200229.pdf?src-supplier=Verical; ComponentLink9Description: https://datasheet.ciiva.com/15200/getdatasheetpartid-453599-15200229.pdf?src-supplier=Verical; ComponentLink10URL: https://datasheet.ciiva.com/2040/21826b-2040113.pdf?src-supplier=Digi-Key; ComponentLink10Description: https://datasheet.ciiva.com/2040/21826b-2040113.pdf?src-supplier=Digi-Key; ComponentLink11URL: https://datasheet.ciiva.com/2040/21826b-2040114.pdf?src-supplier=Digi-Key; ComponentLink11Description: https://datasheet.ciiva.com/2040/21826b-2040114.pdf?src-supplier=Digi-Key; ComponentLink12URL: https://datasheet.ciiva.com/29305/651414-da-01-en-ic-reg-ld-mcp1700t-3302e-tt-sot-23-3-mcp-29305258.pdf?src-supplier=Conrad; ComponentLink12Description: https://datasheet.ciiva.com/29305/651414-da-01-en-ic-reg-ld-mcp1700t-3302e-tt-sot-23-3-mcp-29305258.pdf?src-supplier=Conrad; Supplier Part Number 1: MCP1700T3302ETTDKR-ND